# Altium schematic sheet 2_ADSTM32-MCU.SchDoc
size A4; SheetNumber: 3; SheetTotal: 4
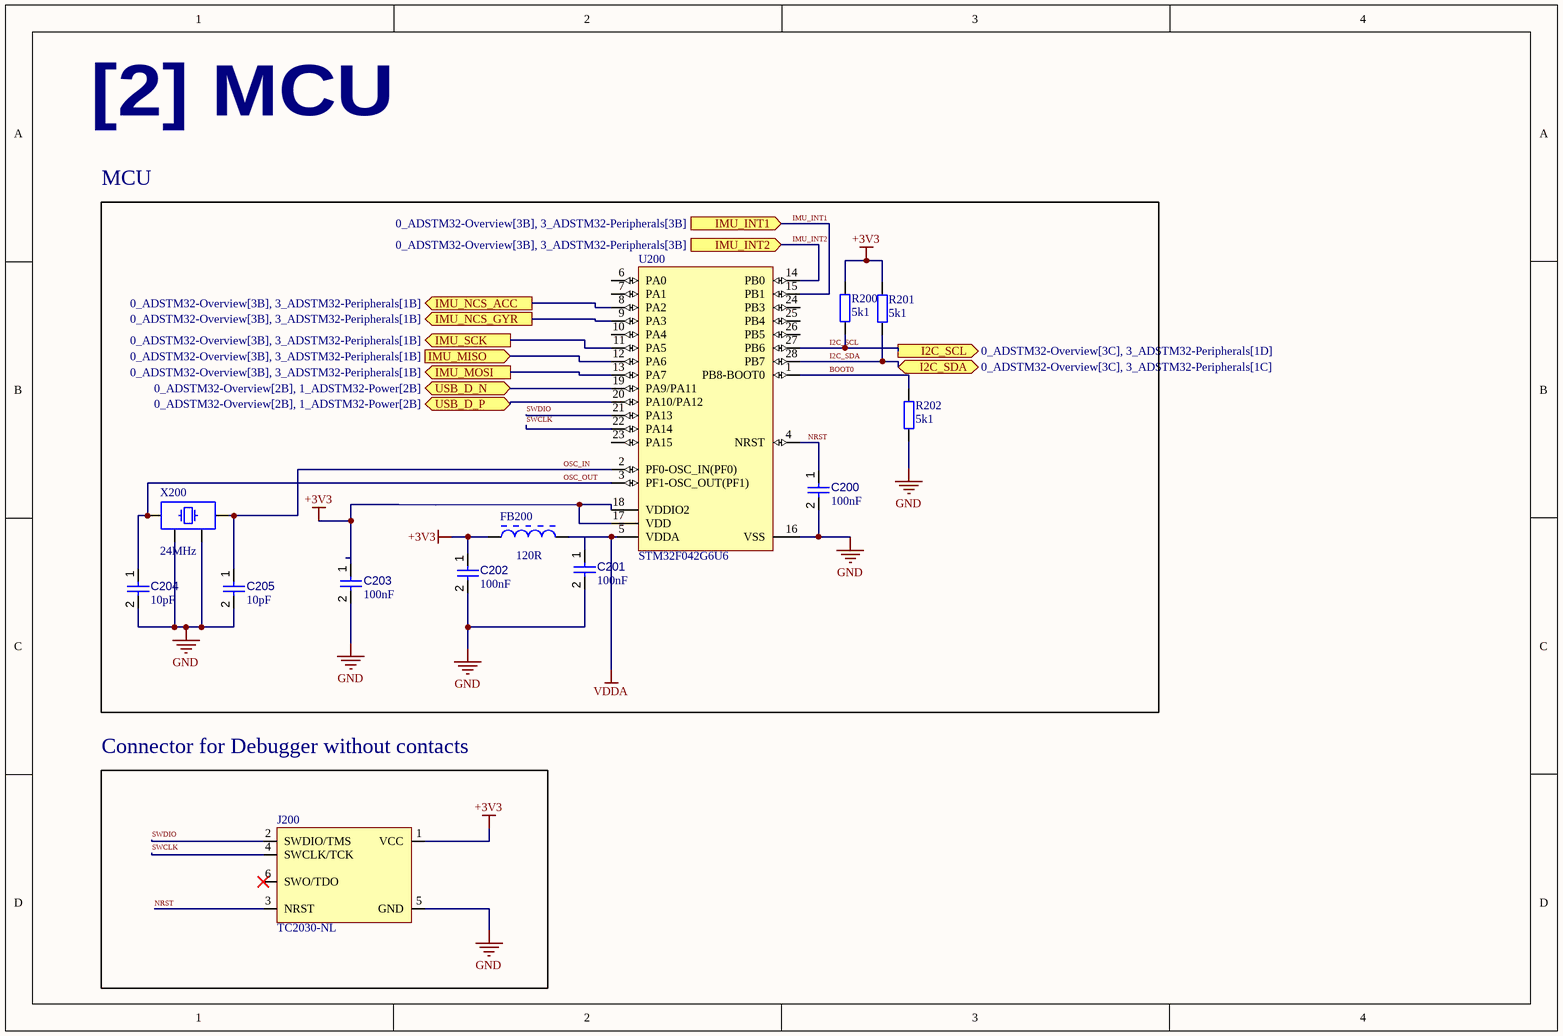
[diagram p0: 2_ADSTM32-MCU.SchDoc]

## Parts
C200  value 100nF  [CAPC1608X90X40NL10T20]  (hidden comment: Capacitor 100 nF +/-10% 50 V 0603)
C201  value 100nF  [CAPC1608X90X40NL10T20]  (hidden comment: Capacitor 100 nF +/-10% 50 V 0603)
C202  value 100nF  [CAPC1608X90X40NL10T20]  (hidden comment: Capacitor 100 nF +/-10% 50 V 0603)
C203  value 100nF  [CAPC1608X90X40NL10T20]  (hidden comment: Capacitor 100 nF +/-10% 50 V 0603)
C204  value 10pF  [CAPC1608X90X40NL10T20]  (hidden comment: Capacitor 100 nF +/-10% 50 V 0603)
C205  value 10pF  [CAPC1608X90X40NL10T20]  (hidden comment: Capacitor 100 nF +/-10% 50 V 0603)
FB200  120R  [INDC2013X105X50ML20T20]
J200  TC2030-NL  [TC2030-NL-FP]  (no BOM)
R200  5k1  [RES_0603]
R201  5k1  [RES_0603]
R202  5k1  [RES_0603]
U200  STM32F042G6U6  [STM-UFQFPN28_V]
X200  24MHz  [XTAL_3225]

## Blocks framed on the sheet
MCU: C200-C205 FB200 R200-R202 U200 X200
Connector for Debugger without contacts: J200

## Ports
I2C_SCL (out, see 0_ADSTM32-Overview[3C], 3_ADSTM32-Peripherals[1D]), I2C_SDA (bidir, see 0_ADSTM32-Overview[3C], 3_ADSTM32-Peripherals[1C]), IMU_INT1 (in, see 0_ADSTM32-Overview[3B], 3_ADSTM32-Peripherals[3B]), IMU_INT2 (in, see 0_ADSTM32-Overview[3B], 3_ADSTM32-Peripherals[3B]), IMU_MISO (in, see 0_ADSTM32-Overview[3B], 3_ADSTM32-Peripherals[1B]), IMU_MOSI (out, see 0_ADSTM32-Overview[3B], 3_ADSTM32-Peripherals[1B]), IMU_NCS_ACC (out, see 0_ADSTM32-Overview[3B], 3_ADSTM32-Peripherals[1B]), IMU_NCS_GYR (out, see 0_ADSTM32-Overview[3B], 3_ADSTM32-Peripherals[1B]), IMU_SCK (out, see 0_ADSTM32-Overview[3B], 3_ADSTM32-Peripherals[1B]), USB_D_N (bidir, see 0_ADSTM32-Overview[2B], 1_ADSTM32-Power[2B]), USB_D_P (bidir, see 0_ADSTM32-Overview[2B], 1_ADSTM32-Power[2B])

## Nets
+3V3: C202.1 C203.1 FB200.1 J200.1(VCC) R200.2 R201.2 U200.17(VDD) U200.18(VDDIO2)
GND: C200.2 C201.2 C202.2 C203.2 C204.2 C205.2 J200.5(GND) R202.1 U200.16(VSS) X200.2 X200.4
VDDA: C201.1 FB200.2 U200.5(VDDA)
BOOT0: R202.2 U200.1(PB8-BOOT0)
I2C_SCL: R200.1 U200.27(PB6) ; port I2C_SCL
I2C_SDA: R201.1 U200.28(PB7) ; port I2C_SDA
IMU_INT1: U200.15(PB1) ; port IMU_INT1
IMU_INT2: U200.14(PB0) ; port IMU_INT2
IMU_MISO: U200.12(PA6) ; port IMU_MISO
IMU_MOSI: U200.13(PA7) ; port IMU_MOSI
IMU_NCS_ACC: U200.8(PA2) ; port IMU_NCS_ACC
IMU_NCS_GYR: U200.9(PA3) ; port IMU_NCS_GYR
IMU_SCK: U200.11(PA5) ; port IMU_SCK
NRST: C200.1 J200.3(NRST) U200.4(NRST)
OSC_IN: C205.1 U200.2(PF0-OSC_IN(PF0)) X200.3
OSC_OUT: C204.1 U200.3(PF1-OSC_OUT(PF1)) X200.1
SWCLK: J200.4(SWCLK/TCK) U200.22(PA14)
SWDIO: J200.2(SWDIO/TMS) U200.21(PA13)
USB_D_N: U200.19(PA9/PA11) ; port USB_D_N
USB_D_P: U200.20(PA10/PA12) ; port USB_D_P

Not connected (* = marked no-connect by the designer): J200 6(SWO/TDO)*; U200 6(PA0) 7(PA1) 10(PA4) 23(PA15) 24(PB3) 25(PB4) 26(PB5)

## Notes on the sheet
- [2] MCU

## Library data of the parts
C200-C205 = CMP-001-00017-6: Chip Capacitor, 100 nF, +/- 10%, 50 V, 0603 (1608 Metric); Voltage Rating: 50V; Capacitor Type: Ceramic; Tolerance: 10%; Mounting Technology: SM; Max Operating Temperature: 125°C; RoHS Compliant: True; Pins: 2; Case/Package: 0603; Min Operating Temperature: -55°C
FB200 = CMP-006-00000-3: Chip Ferrite Bead, 120 Ohm,; Manufacturer: Murata; Current Rating: 1.5A; Impedance: 330Ohm; Resistance: 90mohm; Tolerance: 25%; Max Operating Temperature: 125°C; Core Material: Ferrite; Case/Package: 0805; Mounting Technology: SM; Datasheet URL: http://psearch.en.murata.com/inductor/product/LQG15HS15NJ02_.pdf; Packaging: TapeandReel; Min Operating Temperature: -55°C; RoHS Compliant: True; Max Current Rating: 1.5A; Datasheet Version: Nov-11; Package Quantity: 4000; Package Reference: 0805; Package Description: 2-Pin Surface Mount Device, Body 2 x1.25 mm
J200 = TC2030-NL: Tag-Connect No-Solder SWD Debug Connector (No Legs) DO NOT PLACE; Manufacturer: Tag-Connect; Manufacturer Part Number: TC2030-NL-FP
R200-R202 = RES_0603: Resistor SMD 0603; Manufacturer: *; Manufacturer Part Number: *; Distributor Link: *; LCSC: *
U200 = CMP-0304-00112-2: ARM Cortex-M0 32-bit MCU, 32 KB Flash, 6 KB Internal RAM, 24 I/Os, 28-Pin UFQFPN, -40 to 85 degC, Tray; Manufacturer: STMicroelectronics; FLASH Size (Prog) (kB): 32; I/Os (High Current): 24; Internal RAM Size (kB): 6; Supply Voltage(Vcc) min (V): 2; Operating Frequency(F) (Processor speed) (MHz): 48; Core: ARM Cortex-M0; PartNumber: STM32F042G6U6; Packing: Tray; Package Description: 28-Pin Ultra Thin Fine Pitch Quad Flat No-Lead, 4 x 4 x 0.6 mm Body, 0.5 mm Pitch; ComponentLink2Description: Datasheet; ComponentLink1Description: Manufacturer URL; Package Reference: UFQFPN28; DatasheetVersion: Rev. 5; ComponentLink1URL: http://www.st.com/; ComponentLink2URL: http://www.st.com/st-web-ui/static/active/en/resource/technical/document/datasheet/DM00105814.pdf; Mounting Technology: Surface Mount
X200 = TSX-3225_24.0000MF15X-AC: Crystal SMD 24MHz 10PPM 7pF 3225; Manufacturer: Epson; Manufacturer Part Number: TSX-3225 24.0000MF15X-AC